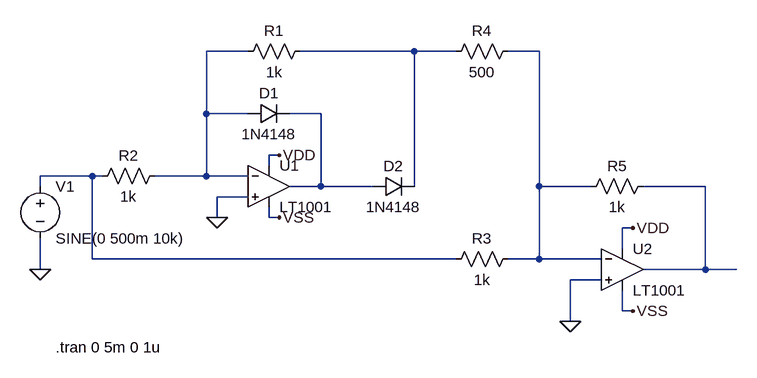
[diagram p0: schematic Draft2.asc]
Draft2.asc, the LTspice schematic file:
Version 4
SHEET 1 1024 680
WIRE -48 -48 -112 -48
WIRE 208 -48 32 -48
WIRE 272 -48 208 -48
WIRE 400 -48 352 -48
WIRE -112 48 -112 -48
WIRE -48 48 -112 48
WIRE 64 48 16 48
WIRE 0 112 -16 112
WIRE -16 128 -16 112
WIRE -288 144 -368 144
WIRE -272 144 -288 144
WIRE -112 144 -112 48
WIRE -112 144 -192 144
WIRE -48 144 -112 144
WIRE -368 160 -368 144
WIRE 64 160 64 48
WIRE 64 160 16 160
WIRE 144 160 64 160
WIRE 208 160 208 -48
WIRE 400 160 400 -48
WIRE 480 160 400 160
WIRE 656 160 560 160
WIRE -48 176 -96 176
WIRE -96 208 -96 176
WIRE -16 208 -16 192
WIRE 0 208 -16 208
WIRE 544 224 528 224
WIRE 528 256 528 224
WIRE -288 272 -288 144
WIRE 272 272 -288 272
WIRE 400 272 400 160
WIRE 400 272 352 272
WIRE 496 272 400 272
WIRE -368 288 -368 240
WIRE 656 288 656 160
WIRE 656 288 560 288
WIRE 704 288 656 288
WIRE 496 304 448 304
WIRE 528 352 528 320
WIRE 544 352 528 352
WIRE 448 368 448 304
FLAG -368 288 0
FLAG -96 208 0
FLAG 448 368 0
FLAG 0 112 VDD
FLAG 544 224 VDD
FLAG 544 352 VSS
FLAG 0 208 VSS
SYMBOL voltage -368 144 R0
WINDOW 123 0 0 Left 2
WINDOW 39 0 0 Left 2
SYMATTR InstName V1
SYMATTR Value SINE(0 500m 10k)
SYMBOL Opamps\\LT1001 -16 96 R0
SYMATTR InstName U1
SYMBOL Opamps\\LT1001 528 224 R0
SYMATTR InstName U2
SYMBOL res 48 -64 R90
WINDOW 0 0 56 VBottom 2
WINDOW 3 32 56 VTop 2
SYMATTR InstName R1
SYMATTR Value 1k
SYMBOL res -176 128 R90
WINDOW 0 0 56 VBottom 2
WINDOW 3 32 56 VTop 2
SYMATTR InstName R2
SYMATTR Value 1k
SYMBOL res 368 256 R90
WINDOW 0 0 56 VBottom 2
WINDOW 3 32 56 VTop 2
SYMATTR InstName R3
SYMATTR Value 1k
SYMBOL res 368 -64 R90
WINDOW 0 0 56 VBottom 2
WINDOW 3 32 56 VTop 2
SYMATTR InstName R4
SYMATTR Value 500
SYMBOL res 576 144 R90
WINDOW 0 0 56 VBottom 2
WINDOW 3 32 56 VTop 2
SYMATTR InstName R5
SYMATTR Value 1k
SYMBOL diode -48 64 R270
WINDOW 0 32 32 VTop 2
WINDOW 3 0 32 VBottom 2
SYMATTR InstName D1
SYMATTR Value 1N4148
SYMBOL diode 144 176 R270
WINDOW 0 32 32 VTop 2
WINDOW 3 0 32 VBottom 2
SYMATTR InstName D2
SYMATTR Value 1N4148
TEXT -344 408 Left 2 !.tran 0 5m 0 1u

The netlist it stands for:
* Draft2.asc
V1 N005 0 SINE(0 500m 10k)
XU1 0 N001 VDD VSS N004 LT1001  ; pins In+ In- V+ V- OUT
XU2 0 N003 VDD VSS N006 LT1001  ; pins In+ In- V+ V- OUT
R1 N002 N001 1k
R2 N001 N005 1k
R3 N003 N005 1k
R4 N003 N002 500
R5 N006 N003 1k
D1 N001 N004 1N4148
D2 N004 N002 1N4148
.model D D
.lib standard.dio
.tran 0 5m 0 1u
.lib LTC.lib
.backanno
.end